# Altium schematic sheet 06_POWER_3.SchDoc
size 420 x 297 mm; SheetNumber: 9; SheetTotal: 22
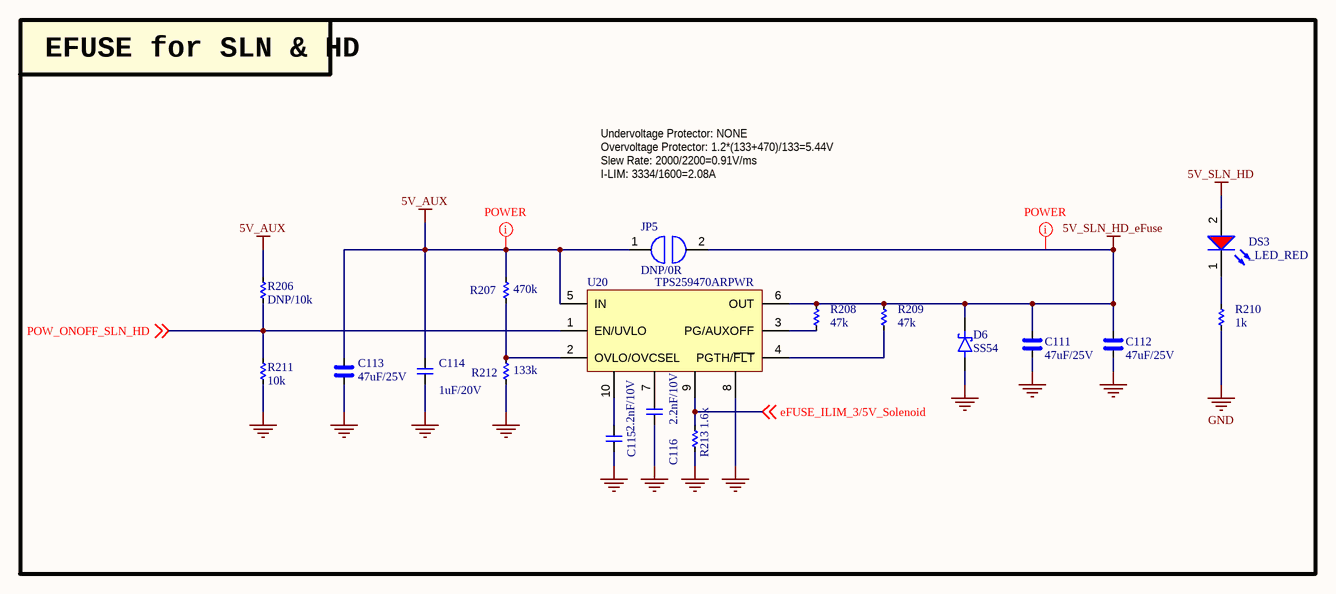
[diagram p0: 06_POWER_3.SchDoc]

## Parts
C111  47uF/25V  [CAP_C_3225X80]
C112  47uF/25V  [CAP_C_3225X80]
C113  47uF/25V  [CAP_C_3225X80]
C114  1uF/20V  [CAP_C_1005X60]
C115  2.2nF/10V  [CAP_C_1005X60]
C116  2.2nF/10V  [CAP_C_1005X60]
D6  SS54  [DO-214AC_SMA]
DS3  _LED_RED  [LED_0603]
JP5  DNP/0R  [JUMPER_1608]
R206  DNP/10k  [RES_C_1005X40]
R207  470k  [RES_C_1005X40]
R208  47k  [RES_C_1005X40]
R209  47k  [RES_C_1005X40]
R210  1k  [RES_C_1005X40]
R211  10k  [RES_C_1005X40]
R212  133k  [RES_C_1005X40]
R213  1.6k  [RES_C_1005X40]
U20  TPS259470ARPWR  [VQFN-HR-10]

## Nets
5V_AUX: C113.2 C114.2 JP5.1 R206.1 R207.2 U20.5(IN)
5V_SLN_HD: DS3.2(A)
5V_SLN_HD_eFuse: C111.2 C112.2 D6.1(K) JP5.2 R208.2 R209.2 U20.6(OUT)
GND: C111.1 C112.1 C113.1 C114.1 C115.1 C116.1 D6.2(A) R210.1 R211.2 R212.1 R213.1 U20.8
eFUSE_ILIM_3/5V_Solenoid: R213.2 U20.9 ; off-sheet eFUSE_ILIM_3/5V_Solenoid
POW_ONOFF_SLN_HD: R206.2 R211.1 U20.1(EN/UVLO) ; off-sheet POW_ONOFF_SLN_HD
NetC115_2: C115.2 U20.10
NetC116_2: C116.2 U20.7
NetDS3_1: DS3.1(K) R210.2
NetR207_1: R207.1 R212.2 U20.2(OVLO/OVCSEL)
NetR208_1: R208.1 U20.3(PG/AUXOFF)
NetR209_1: R209.1 U20.4(PGTH/~{FLT})

## Layout directives
net class POWER: 5V_AUX, 5V_SLN_HD_eFuse

## Notes on the sheet
- EFUSE for SLN & HD
- Undervoltage Protector: NONE
- Overvoltage Protector: 1.2*(133+470)/133=5.44V
- Slew Rate: 2000/2200=0.91V/ms
- I-LIM: 3334/1600=2.08A
- Project:
- Sub-system:
- Design by:
- Sheet title:
- Sheet
- of
- Checked by:
- Approved by:
- Revision:
- Document No:
- Size:
- Date:
- A3

## Library data of the parts
C111-C113 = _CAP_C_High_2: CAP High Value
C114-C116 = _CAP_C_2: CAP
D6 = DIODE SCHOTTKY
JP5 = JUMPER
R206-R213 = _RES_B_2: RES